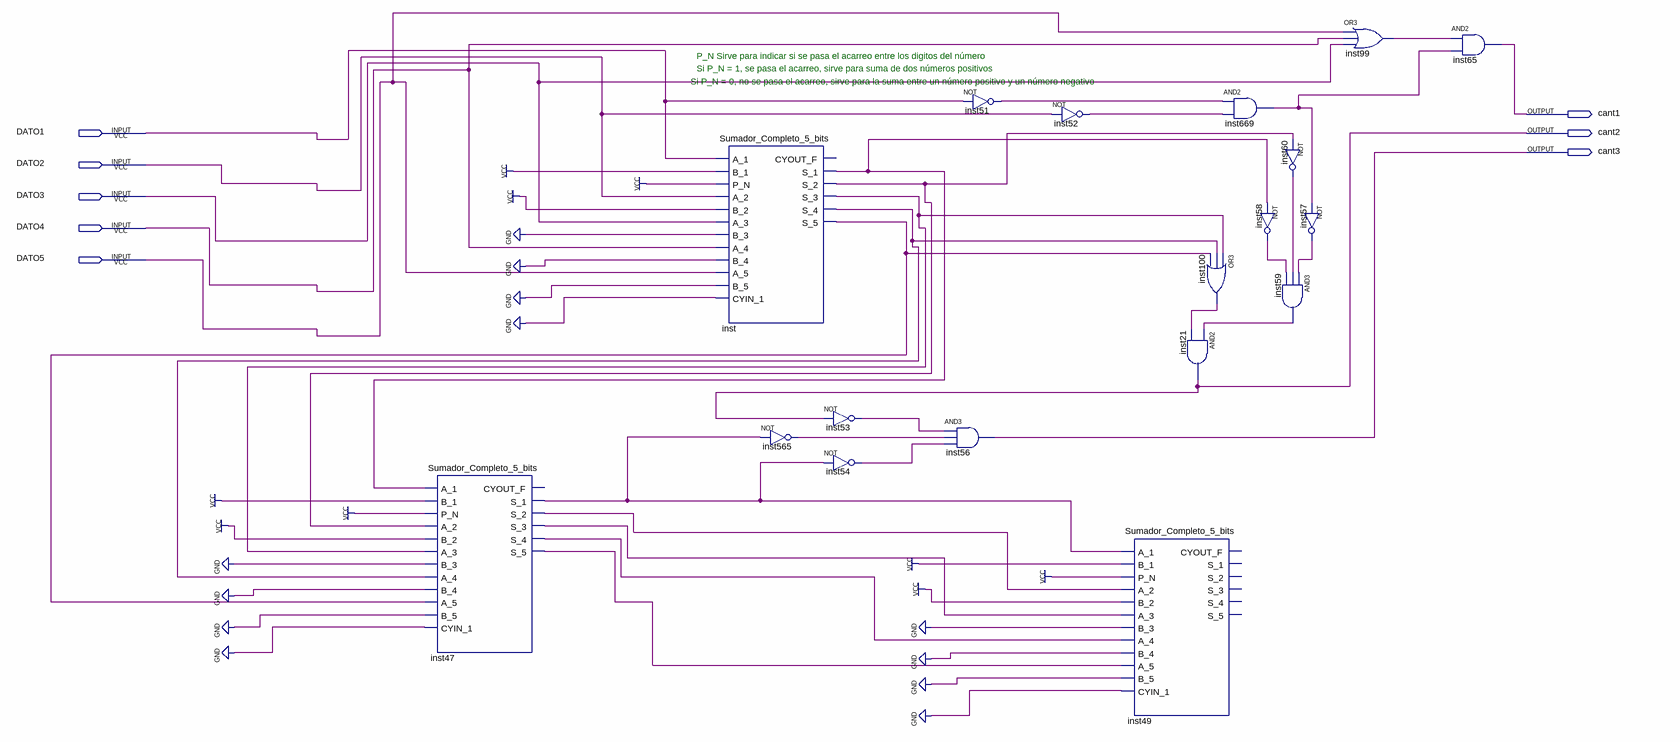
[diagram p0: schematic sheet]
// Quartus schematic Controlador_de_envio_de_datos.bdf as structural Verilog: 18 symbols, 8 pins
module Controlador_de_envio_de_datos (
  input  DATO1,
  input  DATO2,
  input  DATO3,
  input  DATO4,
  input  DATO5,
  output cant1,
  output cant2,
  output cant3
);

  wire inst47_s_1, inst47_s_2, inst47_s_3, inst47_s_4, inst47_s_5, inst51_out, inst52_out, inst53_out,
       inst54_out, inst57_out, inst58_out, inst59_out, inst60_out, inst99_out, inst100_out, inst565_out,
       inst669_out, inst_s_1, inst_s_2, inst_s_3, inst_s_4, inst_s_5;

  Sumador_Completo_5_bits inst47 (
    .A_1(inst_s_1), .B_1(1'b1), .P_N(1'b1), .A_2(inst_s_2), .B_2(1'b1), .A_3(inst_s_3), .B_3(1'b0),
    .A_4(inst_s_4), .B_4(1'b0), .A_5(inst_s_5), .B_5(1'b0), .CYIN_1(1'b0), .S_1(inst47_s_1),
    .S_2(inst47_s_2), .S_3(inst47_s_3), .S_4(inst47_s_4), .S_5(inst47_s_5));  // open: CYOUT_F
  Sumador_Completo_5_bits inst (
    .A_1(DATO1), .B_1(1'b1), .P_N(1'b1), .A_2(DATO2), .B_2(1'b1), .A_3(DATO3), .B_3(1'b0), .A_4(DATO4),
    .B_4(1'b0), .A_5(DATO5), .B_5(1'b0), .CYIN_1(1'b0), .S_1(inst_s_1), .S_2(inst_s_2), .S_3(inst_s_3),
    .S_4(inst_s_4), .S_5(inst_s_5));  // open: CYOUT_F
  not inst565 (inst565_out, inst47_s_1);
  not inst53 (inst53_out, cant2);
  not inst54 (inst54_out, inst47_s_1);
  not inst51 (inst51_out, DATO1);
  and inst56 (cant3, inst53_out, inst565_out, inst54_out);
  not inst52 (inst52_out, DATO2);
  Sumador_Completo_5_bits inst49 (
    .A_1(inst47_s_1), .B_1(1'b1), .P_N(1'b1), .A_2(inst47_s_2), .B_2(1'b1), .A_3(inst47_s_3), .B_3(1'b0),
    .A_4(inst47_s_4), .B_4(1'b0), .A_5(inst47_s_5), .B_5(1'b0), .CYIN_1(1'b0));  // open: CYOUT_F, S_1, S_2, S_3, S_4, S_5
  and inst21 (cant2, inst59_out, inst100_out);
  and inst669 (inst669_out, inst51_out, inst52_out);
  or inst100 (inst100_out, inst_s_3, inst_s_4, inst_s_5);
  not inst60 (inst60_out, inst_s_2);
  not inst58 (inst58_out, inst_s_1);
  and inst59 (inst59_out, inst57_out, inst60_out, inst58_out);
  not inst57 (inst57_out, inst669_out);
  or inst99 (inst99_out, DATO5, DATO4, DATO3);
  and inst65 (cant1, inst99_out, inst669_out);

  // Notes on the sheet:
  //   P_N Sirve para indicar si se pasa el acarreo entre los digitos del número
  //   Si P_N = 1, se pasa el acarreo, sirve para suma de dos números positivos
  //   Si P_N = 0, no se pasa el acarreo, sirve para la suma entre un número positivo y un número negativo
endmodule
